# Altium schematic sheet 光纤采集.SchDoc
size A4
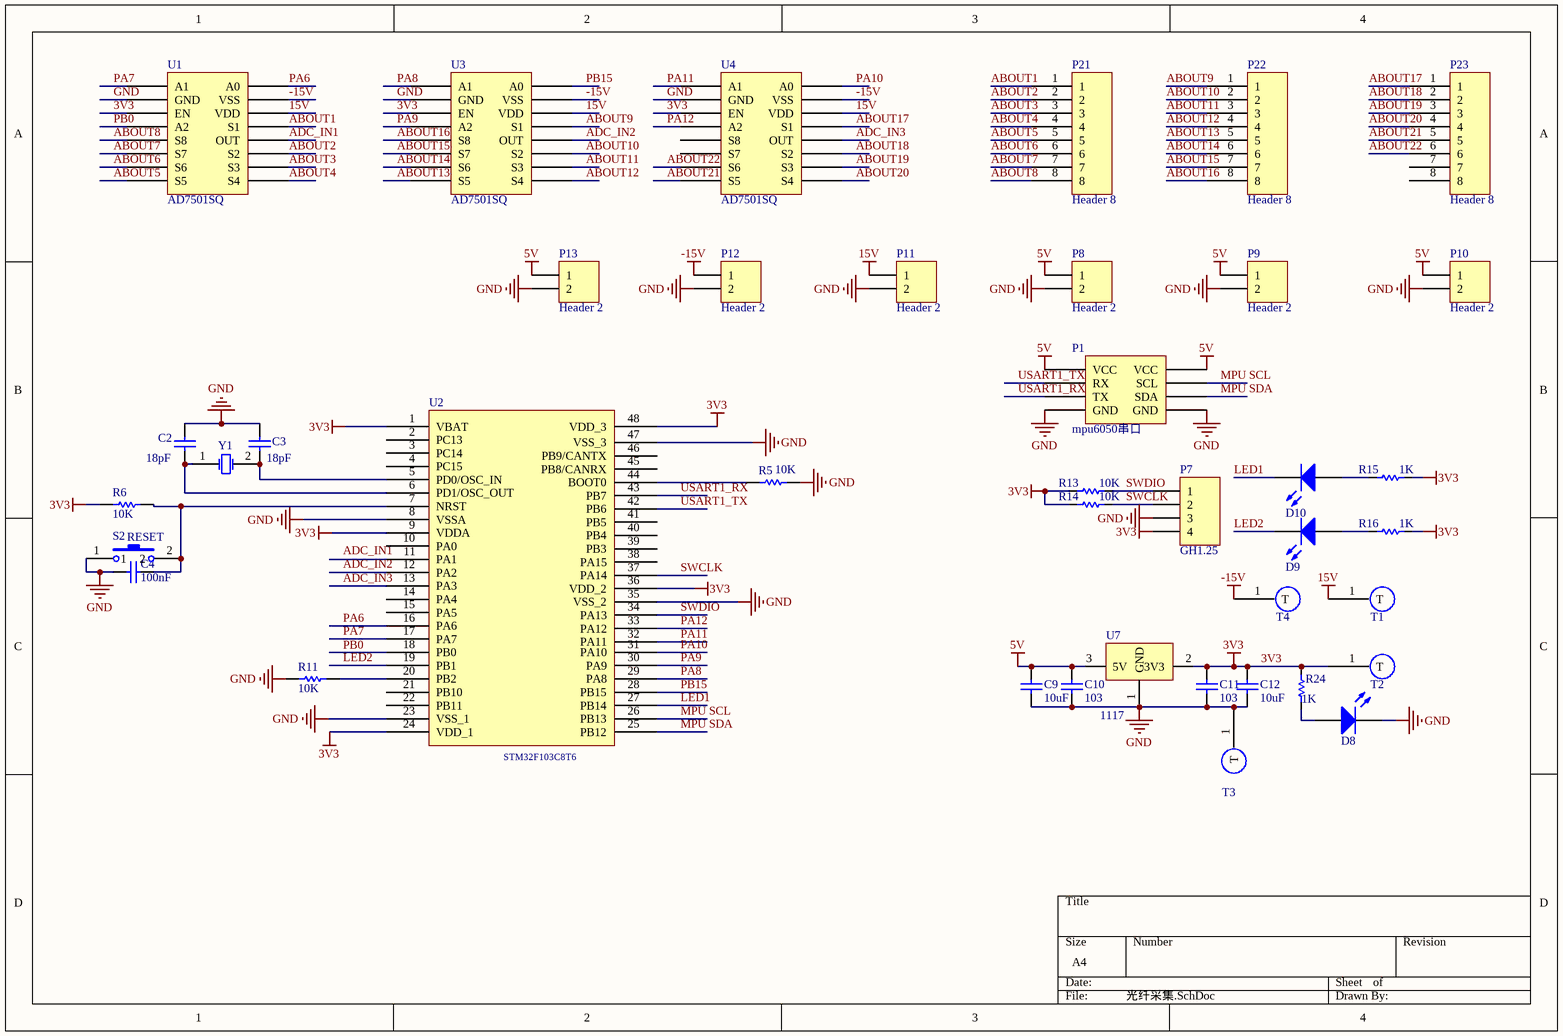
[diagram p0: 光纤采集.SchDoc]

## Parts
C2  value 18pF  [0402]  (hidden comment: Cap)
C3  value 18pF  [0402]  (hidden comment: Cap)
C4  value 100nF  [0402]  (hidden comment: Cap)
C9  10uF  [0603-1]
C10  103  [0603-1]
C11  103  [0603-1]
C12  10uF  [0603-1]
D8  LED0  [0603-LED-1]  (value not drawn)
D9  LED0  [0603-LED-1]  (value not drawn)
D10  LED0  [0603-LED-1]  (value not drawn)
P1  mpu6050串口  [MPU6050]
P7  GH1.25  [GH1.25_4P]
P8  Header 2  [2.54x2]
P9  Header 2  [2.54x2]
P10  Header 2  [2.54x2]
P11  Header 2  [2.54x2]
P12  Header 2  [2.54x2]
P13  Header 2  [2.54x2]
P21  Header 8  [2.54x8]
P22  Header 8  [2.54x8]
P23  Header 8  [2.54x8]
R5  value 10K  [0402]  (hidden comment: Res Semi)
R6  value 10K  [0402]  (hidden comment: Res Semi)
R11  value 10K  [0402]  (hidden comment: Res Semi)
R13  10K  [0402]
R14  10K  [0402]
R15  1K  [0402]
R16  1K  [0402]
R24  1K  [0402]
S2  RESET  [KEY 4P]
T1  (no value)  [Test]
T2  (no value)  [Test]
T3  (no value)  [Test]
T4  (no value)  [Test]
U1  AD7501SQ  [DIP-16]
U2  STM32F103C8T6  [LQFP48_stm32f103_]  (value not drawn)
U3  AD7501SQ  [DIP-16]
U4  AD7501SQ  [DIP-16]
U7  1117  [SOT223_1117__]
Y1  XTAL  [XTAL5032]  (value not drawn)

## Nets
3V3: C11.2 C12.2 P7.4 R6.2 R13.1(TOP) R14.1(TOP) R15.2(BOT) R16.2(BOT) R24.1(TOP) T2.1(T) U1.3(EN) U2.1(VBAT) U2.9(VDDA) U2.24(VDD_1) U2.36(VDD_2) U2.48(VDD_3) U3.3(EN) U4.3(EN) U7.2(3V3)
5V: C9.2 C10.2 P1.1(VCC) P1.8(VCC) P8.1 P9.1 P10.1 P13.1 U7.3(5V)
15V: P11.1 T1.1(T) U1.13(VDD) U3.13(VDD) U4.13(VDD)
-15V: P12.1 T4.1(T) U1.14(VSS) U3.14(VSS) U4.14(VSS)
GND: C2.2 C3.2 C4.2 C9.1 C10.1 C11.1 C12.1 D8.2(K) P1.4(GND) P1.5(GND) P7.3 P8.2 P9.2 P10.2 P11.2 P12.2 P13.2 R5.2 R11.1 S2.1 T3.1(T) U1.2(GND) U2.8(VSSA) U2.23(VSS_1) U2.35(VSS_2) U2.47(VSS_3) U3.2(GND) U4.2(GND) U7.1(GND)
ABOUT1: P21.1 U1.12(S1)
ABOUT2: P21.2 U1.11(S2)
ABOUT3: P21.3 U1.10(S3)
ABOUT4: P21.4 U1.9(S4)
ABOUT5: P21.5 U1.8(S5)
ABOUT6: P21.6 U1.7(S6)
ABOUT7: P21.7 U1.6(S7)
ABOUT8: P21.8 U1.5(S8)
ABOUT9: P22.1 U3.12(S1)
ABOUT10: P22.2 U3.11(S2)
ABOUT11: P22.3 U3.10(S3)
ABOUT12: P22.4 U3.9(S4)
ABOUT13: P22.5 U3.8(S5)
ABOUT14: P22.6 U3.7(S6)
ABOUT15: P22.7 U3.6(S7)
ABOUT16: P22.8 U3.5(S8)
ABOUT17: P23.1 U4.12(S1)
ABOUT18: P23.2 U4.11(S2)
ABOUT19: P23.3 U4.10(S3)
ABOUT20: P23.4 U4.9(S4)
ABOUT21: P23.5 U4.8(S5)
ABOUT22: P23.6 U4.7(S6)
ADC_IN1: U1.12(OUT)
ADC_IN2: U3.12(OUT)
ADC_IN3: U2.13(PA3) U4.12(OUT)
LED1: D10.2(K) U2.27(PB14)
LED2: D9.2(K) U2.19(PB1)
MPU SCL: P1.7(SCL) U2.26(PB13)
MPU SDA: P1.6(SDA) U2.25(PB12)
PA6: U1.15(A0) U2.16(PA6)
PA7: U1.1(A1) U2.17(PA7)
PA8: U2.29(PA8) U3.1(A1)
PA9: U2.30(PA9) U3.4(A2)
PA10: U2.31(PA10) U4.15(A0)
PA11: U2.32(PA11) U4.1(A1)
PA12: U2.33(PA12) U4.4(A2)
PB0: U1.4(A2)
PB15: U2.28(PB15) U3.15(A0)
SWCLK: P7.2 R14.2(BOT) U2.37(PA14)
SWDIO: P7.1 R13.2(BOT) U2.34(PA13)
USART1_RX: P1.3(TX) U2.43(PB7)
USART1_TX: P1.2(RX) U2.42(PB6)
NetC2_1: C2.1 U2.6(PD1/OSC_OUT) Y1.1(OSC1)
NetC3_1: C3.1 U2.5(PD0/OSC_IN) Y1.2(OSC2)
NetC4_1: C4.1 R6.1 S2.2 U2.7(NRST)
NetD8_1: D8.1(A) R24.2(BOT)
NetD9_1: D9.1(A) R16.1(TOP)
NetD10_1: D10.1(A) R15.1(TOP)
NetR5_1: R5.1 U2.44(BOOT0)
NetR11_2: R11.2 U2.20(PB2)

Not connected (* = marked no-connect by the designer): P23 7 8; U2 2(PC13) 3(PC14) 4(PC15) 10(PA0) 11(PA1) 12(PA2) 14(PA4) 15(PA5) 18(PB0) 21(PB10) 22(PB11) 38(PA15) 39(PB3) 40(PB4) 41(PB5) 45(PB8/CANRX) 46(PB9/CANTX); U4 5(S8) 6(S7)

## Notes on the sheet
- Labels drawn without touching a wire or pin: ADC_IN1, ADC_IN2, PB0

## Library data of the parts
C2-C4 = Cap: Capacitor; Published: 8-Jun-2000; LatestRevisionDate: 17-Jul-2002; LatestRevisionNote: Re-released for DXP Platform.; PackageReference: RAD-0.3; Publisher: Altium Limited; PackageDescription: Radial Cap, Thru-Hole; 2 Leads; 0.3 in Pin Spacing
C9-C12 = Cap: 无极性电容; Published: 8-Jun-2000; LatestRevisionDate: 17-Jul-2002; LatestRevisionNote: Re-released for DXP Platform.; PackageReference: RAD-0.3; Publisher: Altium Limited
D8-D10 = LED0: 发光二极管; Published: 8-Jun-2000; LatestRevisionDate: 08-Jul-2005; LatestRevisionNote: Mech Layer 1 removed.; PackageReference: LED-0; Publisher: Altium Limited
P7 = Header 4: Header, 4-Pin; LatestRevisionDate: 17-Jul-2002; LatestRevisionNote: Re-released for DXP Platform.; Publisher: Altium Limited
P8-P13 = Header 2: Header, 2-Pin; LatestRevisionDate: 17-Jul-2002; LatestRevisionNote: Re-released for DXP Platform.; Publisher: Altium Limited
R5 R6 R11 = Res Semi: Semiconductor Resistor; Published: 8-Jun-2000; LatestRevisionDate: 17-Jul-2002; LatestRevisionNote: Re-released for DXP Platform.; PackageReference: AXIAL-0.5; Publisher: Altium Limited; PackageDescription: Axial Device, Thru-Hole; 2 Leads; 0.5 in Pin Spacing
R13 R14 R24 = Res1: 贴片电阻; Published: 8-Jun-2000; LatestRevisionDate: 17-Jul-2002; LatestRevisionNote: Re-released for DXP Platform.; PackageReference: AXIAL-0.4; Publisher: Altium Limited
  R13 R14: Value: 10K
R15 R16 = Res1: 贴片电阻; Value: 10K; Published: 8-Jun-2000; LatestRevisionDate: 17-Jul-2002; LatestRevisionNote: Re-released for DXP Platform.; PackageReference: AXIAL-0.4; Publisher: Altium Limited
S2 = SW-PB: 微动开关; Published: 24-Mar-1999; LatestRevisionDate: 17-Jul-2002; LatestRevisionNote: Re-released for DXP Platform.; PackageReference: SPST-2; Publisher: Altium Limited
T1-T4 = TEST
U7 = AMS1117-3.3
Y1 = XTAL: Crystal Oscillator; Published: 8-Jun-2000; LatestRevisionDate: 17-Jul-2002; LatestRevisionNote: Re-released for DXP Platform.; PackageReference: R38; Publisher: Altium Limited; PackageDescription: Crystal, Thru-Hole; 2 Leads; Body 3.1 x 8.2 mm (Dia.xH)